# Altium project CurrentMonitorAndController.PrjPcb (part 1 of 2)
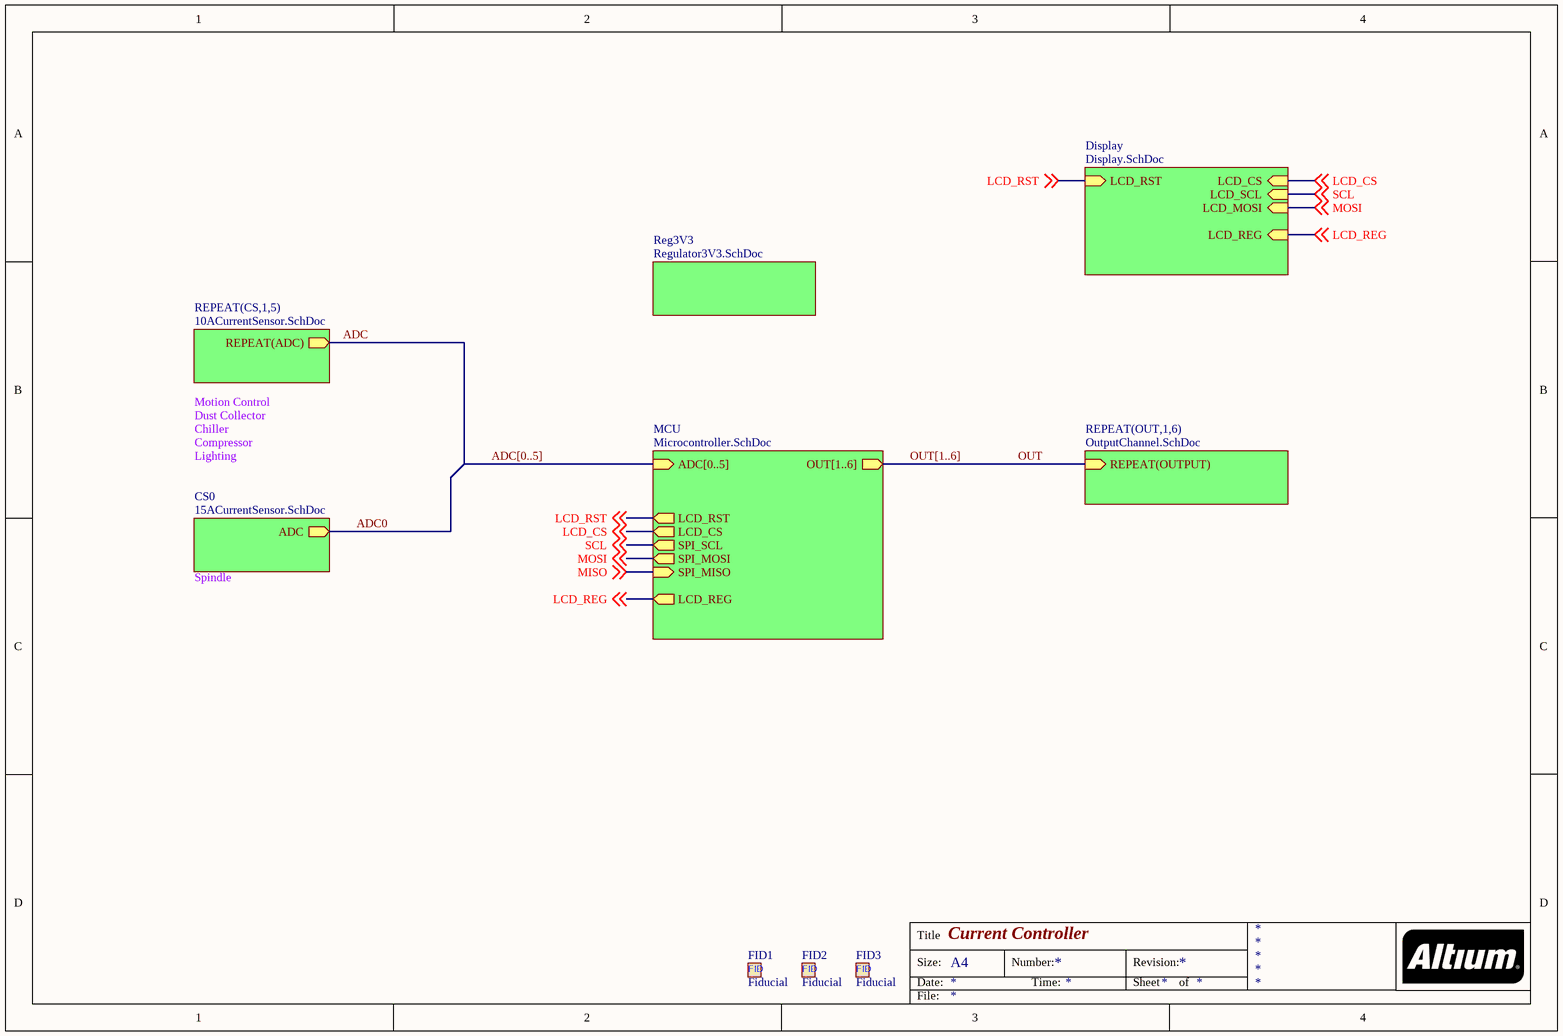
[diagram p0: CurrentManager-top.SchDoc]
7 sheets, 179 parts. Net scope: hierarchical (ports join the sheet entries above them; power ports are global).
Board file: Current Controller Board.PcbDoc
Sheets:
  CurrentManager-top.SchDoc
    CS1 = 10ACurrentSensor.SchDoc
    CS2 = 10ACurrentSensor.SchDoc
    CS3 = 10ACurrentSensor.SchDoc
    CS4 = 10ACurrentSensor.SchDoc
    CS5 = 10ACurrentSensor.SchDoc
    CS0 = 15ACurrentSensor.SchDoc
    MCU = Microcontroller.SchDoc
    Display = Display.SchDoc
    Reg3V3 = Regulator3V3.SchDoc
    OUT1 = OutputChannel.SchDoc
    OUT2 = OutputChannel.SchDoc
    OUT3 = OutputChannel.SchDoc
    OUT4 = OutputChannel.SchDoc
    OUT5 = OutputChannel.SchDoc
    OUT6 = OutputChannel.SchDoc

## Sheet CurrentManager-top.SchDoc: Current Controller
size A4

### Parts
FID1  Fiducial  [Fiducial]  (no BOM)
FID2  Fiducial  [Fiducial]  (no BOM)
FID3  Fiducial  [Fiducial]  (no BOM)

### Sub-sheets
CS0 = 15ACurrentSensor.SchDoc: ADC (out)
Display = Display.SchDoc: LCD_RST (in), LCD_CS (in), LCD_SCL (in), LCD_MOSI (in), LCD_REG (in)
MCU = Microcontroller.SchDoc: ADC[0..5] (in), LCD_RST (out), LCD_CS (out), SPI_SCL (out), SPI_MOSI (out), LCD_REG (out), SPI_MISO (in), OUT[1..6] (out)
Reg3V3 = Regulator3V3.SchDoc: no entries
REPEAT(CS,1,5) = 10ACurrentSensor.SchDoc: REPEAT(ADC) (out)
REPEAT(OUT,1,6) = OutputChannel.SchDoc: REPEAT(OUTPUT) (in)

### Nets
ADC: sheet REPEAT(CS,1,5)/REPEAT(ADC)
LCD_CS: off-sheet LCD_CS, sheet MCU/LCD_CS, sheet Display/LCD_CS
LCD_REG: off-sheet LCD_REG, sheet MCU/LCD_REG, sheet Display/LCD_REG
LCD_RST: off-sheet LCD_RST, sheet MCU/LCD_RST, sheet Display/LCD_RST
MISO: off-sheet MISO, sheet MCU/SPI_MISO  [project net SPI_MISO]
MOSI: off-sheet MOSI, sheet MCU/SPI_MOSI, sheet Display/LCD_MOSI  [project net SPI_MOSI]
OUT: sheet REPEAT(OUT,1,6)/REPEAT(OUTPUT)
SCL: off-sheet SCL, sheet MCU/SPI_SCL, sheet Display/LCD_SCL

### Buses and harness runs
bus ADC[0..5] = sheet MCU/ADC[0..5]
bus OUT[1..6] = sheet MCU/OUT[1..6]

### Notes on the sheet
- Motion Control
- Dust Collector
- Compressor
- Chiller
- Lighting
- Spindle
- Title
- Size:
- Date:
- A4
- Number:
- Time:
- Revision:
- Sheet
- of
- File:
- (in symbol Fiducial) FID

## Sheet 10ACurrentSensor.SchDoc
size A4
Used 5 times, as channels CS1, CS2, CS3, CS4, CS5. Parts and nets are listed once, with the designators drawn on the sheet.
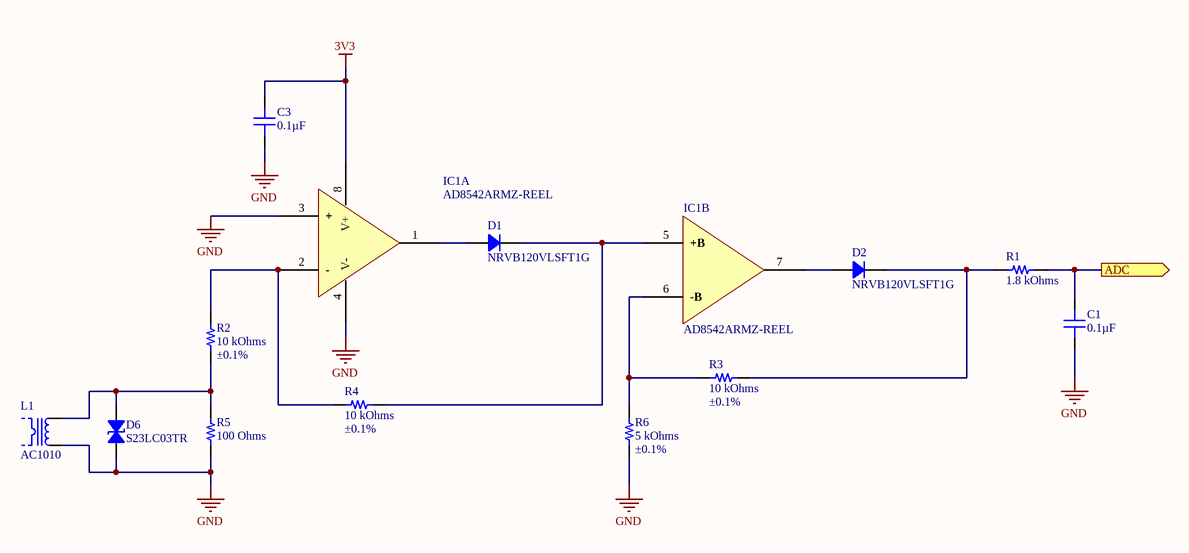
[diagram p1: 10ACurrentSensor.SchDoc]

### Parts
C1  0.1µF  [CAP 0603_1608]
C3  0.1µF  [CAP 0603_1608]
D1  NRVB120VLSFT1G  [SOD123F]
D2  NRVB120VLSFT1G  [SOD123F]
D6  S23LC03TR  [DIODES SOT-23-3]
IC1  AD8542ARMZ-REEL  [ANALOG MSOP-8 RM-8]  (parts A,B of 2)
L1  AC1010  [TALEMA AC1010]
R1  1.8 kOhms  [RES 0603_1608]
R2  Tolerance: ±0.1%  [RES 0603_1608]  (hidden comment: 10 kOhms)
R3  Tolerance: ±0.1%  [RES 0603_1608]  (hidden comment: 10 kOhms)
R4  Tolerance: ±0.1%  [RES 0603_1608]  (hidden comment: 10 kOhms)
R5  100 Ohms  [RES 0603_1608]
R6  Tolerance: ±0.1%  [RES 0603_1608]  (hidden comment: 5 kOhms)

### Ports
ADC (out)

### Nets
3V3: C3.2 IC1.8(V+)
GND: C1.1 C3.1 D6.1 IC1.3(+) IC1.4(V-) L1.1 R5.1 R6.2
ADC: C1.2 R1.2 ; port ADC
NetD1_1: D1.1 IC1.1(OUT)
NetD1_2: D1.2 IC1.5(+B) R4.1
NetD2_1: D2.1 IC1.7(OUT_B)
NetD2_2: D2.2 R1.1 R3.1
NetD6_2: D6.2 L1.2 R2.1 R5.2
NetIC1_2: IC1.2(-) R2.2 R4.2
NetIC1_6: IC1.6(-B) R3.2 R6.1

### Channels
CS1: designators end in _CS1; ports ADC=ADC1
CS2: designators end in _CS2; ports ADC=ADC2
CS3: designators end in _CS3; ports ADC=ADC3
CS4: designators end in _CS4; ports ADC=ADC4
CS5: designators end in _CS5; ports ADC=ADC5

### Notes on the sheet
- Title
- Size:
- Date:
- A4
- Number:
- Time:
- Revision:
- Sheet
- of
- File:

### Library data of the parts
C1 C3 = CS0603KRX7R7BB104: CAP CER 0.1UF 16V X7R 0603; Manufacturer: Yageo; Tolerance: ±10%; Part Number: CS0603KRX7R7BB104; Value: 0.1µF; Applications: Boardflex Sensitive; Capacitance: 0.1µF; ComponentLink1Description: Datasheet; ComponentLink1URL: http://www.yageo.com/NewPortal/yageodocoutput?fileName=/pdf/MLCC/UPY-ST_NPOX7R_16V-to-3KV_5.pdf; ComponentLink2Description: DigiKey Link; ComponentLink2URL: http://digikey.com/product-detail/en/yageo/CS0603KRX7R7BB104/311-3560-1-ND/7648487; Device Package: 0603 (1608 Metric); Features: Soft Termination; LastUpdated: 02/01/2020 00:02:08; Lifecycle Status: Active; Minimum Order: 1; Mounting Type: Surface Mount, MLCC; Operating Temperature: -55°C ~ 125°C; Package / Case: 0603 (1608 Metric); Packaging: ReReel; PartId: 2286; Part Status: Active; Price: 0.00; Series: CS; Size / Dimension: 0.063" L x 0.031" W (1.60mm x 0.80mm); Supplier 1: DigiKey; Supplier Part Number 1: 311-3560-1-ND; Temperature Coefficient: X7R; Thickness (Max): 0.037" (0.95mm); Voltage - Rated: 16V
D1 D2 = NRVB120VLSFT1G: DIODE SCHOTTKY 20V 1A SOD123; Manufacturer: ON Semiconductor; Current - Reverse Leakage @ Vr: 15mA @ 20V; Speed: Fast Recovery =< 500ns, > 200mA (Io); Voltage - Forward (Vf) (Max) @ If: 300mV @ 1A; Part Number: NRVB120VLSFT1G; ComponentLink1Description: Datasheet; ComponentLink1URL: http://www.onsemi.com/pub/Collateral/MBR120VLSFT1-D.PDF; ComponentLink2Description: DigiKey Link; ComponentLink2URL: http://digikey.com/product-detail/en/on-semiconductor/NRVB120VLSFT1G/NRVB120VLSFT1GOSCT-ND/8538727; Current - Average Rectified (Io): 1A; Device Package: SOD-123F; Diode Type: Schottky; LastUpdated: 02/01/2020 00:13:05; Lifecycle Status: Active; Minimum Order: 1; Mounting Type: Surface Mount; Operating Temperature - Junction: -65°C ~ 125°C; Package / Case: SOD-123F; Packaging: ReReel; PartId: 2453; Part Status: Active; Price: 0.00; Series: Automotive, AEC-Q101; Supplier 1: DigiKey; Supplier Part Number 1: NRVB120VLSFT1GOSCT-ND; Supplier Device Package: SOD-123FL; Voltage - DC Reverse (Vr) (Max): 20V
D6 = S23LC03TR: TVS DIODE 3.3V 8V SOT23; Manufacturer: SMC Diode Solutions; Capacitance @ Frequency: 3pF @ 1MHz; Current - Peak Pulse (10/1000µs): 1A; Power Line Protection: No; Power - Peak Pulse: 300W; Type: Zener; Unidirectional Channels: 1; Voltage - Breakdown (Min): 4V; Voltage - Reverse Standoff (Typ): 3.3V (Max); Part Number: S23LC03TR; Applications: General Purpose; ComponentLink1Description: Datasheet; ComponentLink1URL: http://www.smc-diodes.com/propdf/S23LC03%20THRU%20S23LC24%20N0292%20REV.A.pdf; ComponentLink2Description: DigiKey Link; ComponentLink2URL: http://digikey.com/product-detail/en/smc-diode-solutions/S23LC03TR/1655-1994-1-ND/9562561; Device Package: TO-236-3, SC-59, SOT-23-3; LastUpdated: 12/01/2020 00:14:20; Lifecycle Status: Active; Minimum Order: 1; Mounting Type: Surface Mount; Operating Temperature: -55°C ~ 125°C (TJ); Package / Case: TO-236-3, SC-59, SOT-23-3; Packaging: TapeAndReel; PartId: 346; Part Status: Active; Price: 0.04; Series: -; Supplier 1: DigiKey; Supplier Part Number 1: 1655-1994-1-ND; Supplier Device Package: SOT-23; Voltage - Clamping (Max) @ Ipp: 8V
IC1 = AD8542ARMZ-REEL: IC OPAMP GP 2 CIRCUIT 8MSOP; Manufacturer: Analog Devices Inc.; Amplifier Type: General Purpose; Current - Input Bias: 4pA; Current - Output / Channel: 30mA; Current - Supply: 45µA; Gain Bandwidth Product: 1MHz; Number of Circuits: 2; Output Type: Rail-to-Rail; Slew Rate: 0.92V/µs; Voltage - Input Offset: 1mV; Voltage - Supply, Single/Dual (±): 2.7V ~ 5.5V; Part Number: AD8542ARMZ-REEL; ComponentLink1Description: Datasheet; ComponentLink1URL: https://www.analog.com/media/en/technical-documentation/data-sheets/AD8541_8542_8544.pdf; ComponentLink2Description: DigiKey Link; ComponentLink2URL: http://digikey.com/product-detail/en/analog-devices-inc/AD8542ARMZ-REEL/AD8542ARMZ-REELCT-ND/1957825; Device Package: 8-TSSOP, 8-MSOP (0.118", 3.00mm Width); LastUpdated: 08/01/2020 23:28:44; Lifecycle Status: Active; Minimum Order: 1; Mounting Type: Surface Mount; Operating Temperature: -40°C ~ 125°C; Package / Case: 8-TSSOP, 8-MSOP (0.118", 3.00mm Width); Packaging: ReReel; PartId: 7; Part Status: Active; Price: 0.00; Series: -; Supplier 1: DigiKey; Supplier Part Number 1: AD8542ARMZ-REELCT-ND; Supplier Device Package: 8-MSOP
L1 = AC1010: CURR SENSE XFMR 10A T/H; Manufacturer: Talema Group LLC; Current Ratio: 1000:1; DC Resistance (DCR): 41.8Ohm; Frequency Range: 50/60Hz; Type: Non-Invasive (Solid Core); Part Number: AC1010; ComponentLink1Description: Datasheet; ComponentLink1URL: http://www.talema.com/uploads/documents/product-datasheets/AC%20Series.pdf; ComponentLink2Description: DigiKey Link; ComponentLink2URL: http://digikey.com/product-detail/en/talema-group-llc/AC1010/1295-1102-ND/3881333; Current Rating (Amps): 10A; Height - Seated (Max): 0.937" (23.80mm); LastUpdated: 07/01/2020 18:42:16; Lifecycle Status: Active; Minimum Order: 1; Mounting Type: Through Hole; Packaging: Tube; Part Status: Active; Price: 5.81; Series: AC; Size / Dimension: 0.937" L x 0.438" W (23.80mm x 11.12mm); Supplier 1: DigiKey; Supplier Part Number 1: 1295-1102-ND; Termination Style: PC Pin
R1 = RMCF0603JT1K80: RES 1.8K OHM 5% 1/10W 0603; Manufacturer: Stackpole Electronics Inc; Power (Watts): 0.1W, 1/10W; Temperature Coefficient: ±200ppm/°C; Part Number: RMCF0603JT1K80; Value: 1.8 kOhms; ComponentLink1Description: Datasheet; ComponentLink1URL: https://www.seielect.com/catalog/sei-rmcf_rmcp.pdf; ComponentLink2Description: DigiKey Link; ComponentLink2URL: http://digikey.com/product-detail/en/stackpole-electronics-inc/RMCF0603JT1K80/RMCF0603JT1K80CT-ND/1943176; Composition: Thick Film; Device Package: 0603 (1608 Metric); Features: Automotive AEC-Q200; Height - Seated (Max): 0.022" (0.55mm); LastUpdated: 02/01/2020 00:07:01; Lifecycle Status: Active; Minimum Order: 1; Number of Terminations: 2; Operating Temperature: -55°C ~ 155°C; Package / Case: 0603 (1608 Metric); Packaging: TapeAndReel; PartId: 5907; Part Status: Active; Price: 0.00; Ratings: AEC-Q200; Resistance: 1.8 kOhms; Series: RMCF; Size / Dimension: 0.061" L x 0.031" W (1.55mm x 0.80mm); Supplier 1: DigiKey; Supplier Part Number 1: RMCF0603JT1K80CT-ND; Supplier Device Package: 0603; Tolerance: ±5%
R2-R4 = ERA-3AEB103V: RES SMD 10K OHM 0.1% 1/10W 0603; Manufacturer: Panasonic Electronic Components; Power (Watts): 0.1W, 1/10W; Temperature Coefficient: ±25ppm/°C; Part Number: ERA-3AEB103V; Value: 10 kOhms; ComponentLink1Description: Datasheet; ComponentLink1URL: https://industrial.panasonic.com/cdbs/www-data/pdf/RDM0000/AOA0000C307.pdf; ComponentLink2Description: DigiKey Link; ComponentLink2URL: http://digikey.com/product-detail/en/panasonic-electronic-components/ERA-3AEB103V/P10KDBCT-ND/1466076; Composition: Thin Film; Device Package: 0603 (1608 Metric); Features: Automotive AEC-Q200; Height - Seated (Max): 0.022" (0.55mm); LastUpdated: 02/01/2020 00:07:02; Lifecycle Status: Active; Minimum Order: 1; Number of Terminations: 2; Operating Temperature: -55°C ~ 155°C; Package / Case: 0603 (1608 Metric); Packaging: ReReel; PartId: 5506; Part Status: Active; Price: 0.00; Ratings: AEC-Q200; Resistance: 10 kOhms; Series: ERA-3A; Size / Dimension: 0.063" L x 0.031" W (1.60mm x 0.80mm); Supplier 1: DigiKey; Supplier Part Number 1: P10KDBCT-ND; Supplier Device Package: 0603
R5 = ESR03EZPJ101: RES SMD 100 OHM 5% 1/4W 0603; Manufacturer: Rohm Semiconductor; Power (Watts): 0.25W, 1/4W; Temperature Coefficient: ±200ppm/°C; Part Number: ESR03EZPJ101; Value: 100 Ohms; ComponentLink1Description: Datasheet; ComponentLink1URL: https://www.rohm.com/datasheet/ESR01MZPF/esr-e; ComponentLink2Description: DigiKey Link; ComponentLink2URL: http://digikey.com/product-detail/en/rohm-semiconductor/ESR03EZPJ101/RHM100DCT-ND/1983776; Composition: Thick Film; Device Package: 0603 (1608 Metric); Features: Automotive AEC-Q200, Pulse Withstanding; Height - Seated (Max): 0.022" (0.55mm); LastUpdated: 02/01/2020 00:07:02; Lifecycle Status: Active; Minimum Order: 1; Number of Terminations: 2; Operating Temperature: -55°C ~ 155°C; Package / Case: 0603 (1608 Metric); Packaging: ReReel; PartId: 5450; Part Status: Active; Price: 0.00; Ratings: AEC-Q200; Resistance: 100 Ohms; Series: ESR; Size / Dimension: 0.063" L x 0.031" W (1.60mm x 0.80mm); Supplier 1: DigiKey; Supplier Part Number 1: RHM100DCT-ND; Supplier Device Package: 0603; Tolerance: ±5%
R6 = PNM0603E5001BST5: RES SMD 5K OHM 0.1% 0.15W 0603; Manufacturer: Vishay Thin Film; Temperature Coefficient: ±25ppm/°C; Part Number: PNM0603E5001BST5; Value: 5 kOhms; ComponentLink1Description: Datasheet; ComponentLink1URL: http://www.vishay.com/docs/60057/pnm.pdf; ComponentLink2Description: DigiKey Link; ComponentLink2URL: http://digikey.com/product-detail/en/vishay-thin-film/PNM0603E5001BST5/PNM0603-5.0KBCT-ND/2120383; Composition: Thin Film; Device Package: 0603 (1608 Metric); Features: Anti-Sulfur, Moisture Resistant, Non-Inductive, Non-Magnetic; Height - Seated (Max): 0.020" (0.51mm); LastUpdated: 02/01/2020 00:06:54; Lifecycle Status: Active; Minimum Order: 1; Number of Terminations: 2; Operating Temperature: -55°C ~ 155°C; Package / Case: 0603 (1608 Metric); Packaging: ReReel; PartId: 11960; Part Status: Active; Power (Watts): 0.15W; Price: 0.00; Resistance: 5 kOhms; Series: PNM; Size / Dimension: 0.064" L x 0.032" W (1.63mm x 0.81mm); Supplier 1: DigiKey; Supplier Part Number 1: PNM0603-5.0KBCT-ND; Supplier Device Package: 0603

## Sheet 15ACurrentSensor.SchDoc
size A4
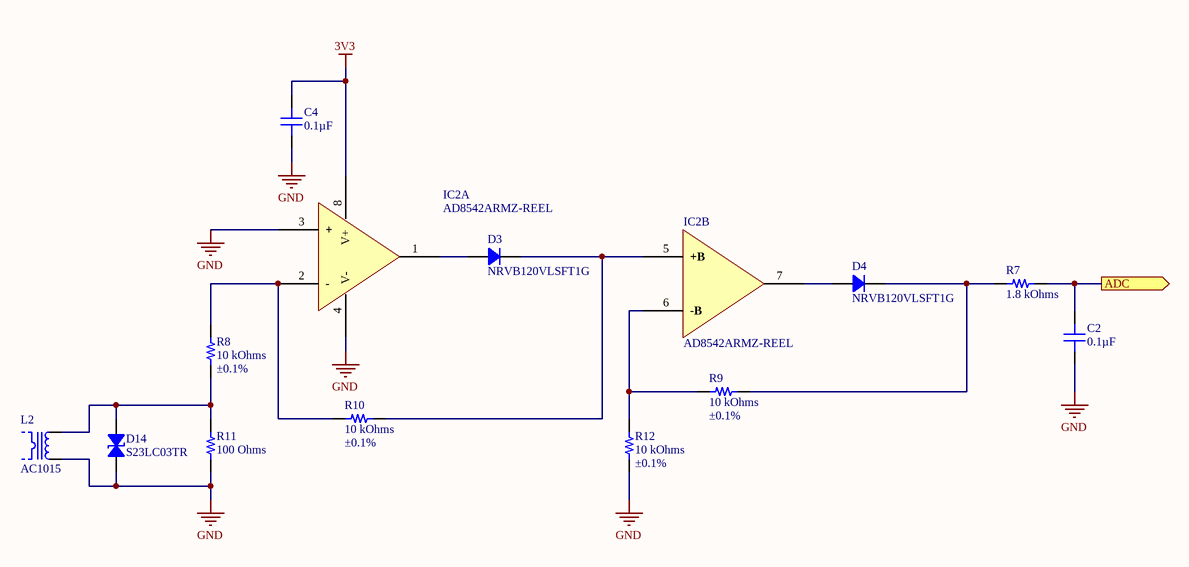
[diagram p2: 15ACurrentSensor.SchDoc]

### Parts
C2  0.1µF  [CAP 0603_1608]
C4  0.1µF  [CAP 0603_1608]
D3  NRVB120VLSFT1G  [SOD123F]
D4  NRVB120VLSFT1G  [SOD123F]
D14  S23LC03TR  [DIODES SOT-23-3]
IC2  AD8542ARMZ-REEL  [ANALOG MSOP-8 RM-8]  (parts A,B of 2)
L2  AC1015  [TALEMA AC1015]
R7  1.8 kOhms  [RES 0603_1608]
R8  Tolerance: ±0.1%  [RES 0603_1608]  (hidden comment: 10 kOhms)
R9  Tolerance: ±0.1%  [RES 0603_1608]  (hidden comment: 10 kOhms)
R10  Tolerance: ±0.1%  [RES 0603_1608]  (hidden comment: 10 kOhms)
R11  100 Ohms  [RES 0603_1608]
R12  Tolerance: ±0.1%  [RES 0603_1608]  (hidden comment: 10 kOhms)

### Ports
ADC (out)

### Nets
3V3: C4.2 IC2.8(V+)
GND: C2.1 C4.1 D14.1 IC2.3(+) IC2.4(V-) L2.1 R11.1 R12.2
ADC0: C2.2 R7.2 ; port ADC
NetD3_1: D3.1 IC2.1(OUT)
NetD3_2: D3.2 IC2.5(+B) R10.1
NetD4_1: D4.1 IC2.7(OUT_B)
NetD4_2: D4.2 R7.1 R9.1
NetD14_2: D14.2 L2.2 R8.1 R11.2
NetIC2_2: IC2.2(-) R8.2 R10.2
NetIC2_6: IC2.6(-B) R9.2 R12.1

### Notes on the sheet
- Title
- Size:
- Date:
- A4
- Number:
- Time:
- Revision:
- Sheet
- of
- File:

### Library data of the parts
C2 C4 = CS0603KRX7R7BB104: as C1 on sheet 10ACurrentSensor; Part Number: CS0603KRX7R7BB104; Value: 0.1µF; Applications: Boardflex Sensitive; Capacitance: 0.1µF; ComponentLink1Description: Datasheet; ComponentLink1URL: http://www.yageo.com/NewPortal/yageodocoutput?fileName=/pdf/MLCC/UPY-ST_NPOX7R_16V-to-3KV_5.pdf; ComponentLink2Description: DigiKey Link; ComponentLink2URL: http://digikey.com/product-detail/en/yageo/CS0603KRX7R7BB104/311-3560-1-ND/7648487; Device Package: 0603 (1608 Metric); Features: Soft Termination; LastUpdated: 02/01/2020 00:02:08; Lifecycle Status: Active; Minimum Order: 1; Mounting Type: Surface Mount, MLCC; Operating Temperature: -55°C ~ 125°C; Package / Case: 0603 (1608 Metric); Packaging: ReReel; PartId: 2286; Part Status: Active; Price: 0.00; Series: CS; Size / Dimension: 0.063" L x 0.031" W (1.60mm x 0.80mm); Supplier 1: DigiKey; Supplier Part Number 1: 311-3560-1-ND; Temperature Coefficient: X7R; Thickness (Max): 0.037" (0.95mm); Voltage - Rated: 16V
D3 D4 = NRVB120VLSFT1G: as D1 on sheet 10ACurrentSensor; Part Number: NRVB120VLSFT1G; ComponentLink1Description: Datasheet; ComponentLink1URL: http://www.onsemi.com/pub/Collateral/MBR120VLSFT1-D.PDF; ComponentLink2Description: DigiKey Link; ComponentLink2URL: http://digikey.com/product-detail/en/on-semiconductor/NRVB120VLSFT1G/NRVB120VLSFT1GOSCT-ND/8538727; Current - Average Rectified (Io): 1A; Device Package: SOD-123F; Diode Type: Schottky; LastUpdated: 02/01/2020 00:13:05; Lifecycle Status: Active; Minimum Order: 1; Mounting Type: Surface Mount; Operating Temperature - Junction: -65°C ~ 125°C; Package / Case: SOD-123F; Packaging: ReReel; PartId: 2453; Part Status: Active; Price: 0.00; Series: Automotive, AEC-Q101; Supplier 1: DigiKey; Supplier Part Number 1: NRVB120VLSFT1GOSCT-ND; Supplier Device Package: SOD-123FL; Voltage - DC Reverse (Vr) (Max): 20V
D14 = S23LC03TR: as D6 on sheet 10ACurrentSensor; Part Number: S23LC03TR; Applications: General Purpose; ComponentLink1Description: Datasheet; ComponentLink1URL: http://www.smc-diodes.com/propdf/S23LC03%20THRU%20S23LC24%20N0292%20REV.A.pdf; ComponentLink2Description: DigiKey Link; ComponentLink2URL: http://digikey.com/product-detail/en/smc-diode-solutions/S23LC03TR/1655-1994-1-ND/9562561; Device Package: TO-236-3, SC-59, SOT-23-3; LastUpdated: 12/01/2020 00:14:20; Lifecycle Status: Active; Minimum Order: 1; Mounting Type: Surface Mount; Operating Temperature: -55°C ~ 125°C (TJ); Package / Case: TO-236-3, SC-59, SOT-23-3; Packaging: TapeAndReel; PartId: 346; Part Status: Active; Price: 0.04; Series: -; Supplier 1: DigiKey; Supplier Part Number 1: 1655-1994-1-ND; Supplier Device Package: SOT-23; Voltage - Clamping (Max) @ Ipp: 8V
IC2 = AD8542ARMZ-REEL: as IC1 on sheet 10ACurrentSensor; Part Number: AD8542ARMZ-REEL; ComponentLink1Description: Datasheet; ComponentLink1URL: https://www.analog.com/media/en/technical-documentation/data-sheets/AD8541_8542_8544.pdf; ComponentLink2Description: DigiKey Link; ComponentLink2URL: http://digikey.com/product-detail/en/analog-devices-inc/AD8542ARMZ-REEL/AD8542ARMZ-REELCT-ND/1957825; Device Package: 8-TSSOP, 8-MSOP (0.118", 3.00mm Width); LastUpdated: 08/01/2020 23:28:44; Lifecycle Status: Active; Minimum Order: 1; Mounting Type: Surface Mount; Operating Temperature: -40°C ~ 125°C; Package / Case: 8-TSSOP, 8-MSOP (0.118", 3.00mm Width); Packaging: ReReel; PartId: 7; Part Status: Active; Price: 0.00; Series: -; Supplier 1: DigiKey; Supplier Part Number 1: AD8542ARMZ-REELCT-ND; Supplier Device Package: 8-MSOP
L2 = AC1015: CURR SENSE XFMR 15A T/H; Manufacturer: Talema Group LLC; Current Ratio: 1000:1; DC Resistance (DCR): 41.8Ohm; Frequency Range: 50/60Hz; Type: Non-Invasive (Solid Core); Part Number: AC1015; ComponentLink1Description: Datasheet; ComponentLink1URL: http://www.talema.com/uploads/documents/product-datasheets/AC%20Series.pdf; ComponentLink2Description: DigiKey Link; ComponentLink2URL: http://digikey.com/product-detail/en/talema-group-llc/AC1015/1295-1097-ND/3881397; Current Rating (Amps): 15A; Height - Seated (Max): 0.937" (23.80mm); LastUpdated: 07/01/2020 18:42:34; Lifecycle Status: Active; Minimum Order: 1; Mounting Type: Through Hole; Packaging: Tube; Part Status: Active; Price: 5.81; Series: AC; Size / Dimension: 0.937" L x 0.438" W (23.80mm x 11.12mm); Supplier 1: DigiKey; Supplier Part Number 1: 1295-1097-ND; Termination Style: PC Pin
R7 = RMCF0603JT1K80: as R1 on sheet 10ACurrentSensor; Part Number: RMCF0603JT1K80; Value: 1.8 kOhms; ComponentLink1Description: Datasheet; ComponentLink1URL: https://www.seielect.com/catalog/sei-rmcf_rmcp.pdf; ComponentLink2Description: DigiKey Link; ComponentLink2URL: http://digikey.com/product-detail/en/stackpole-electronics-inc/RMCF0603JT1K80/RMCF0603JT1K80CT-ND/1943176; Composition: Thick Film; Device Package: 0603 (1608 Metric); Features: Automotive AEC-Q200; Height - Seated (Max): 0.022" (0.55mm); LastUpdated: 02/01/2020 00:07:01; Lifecycle Status: Active; Minimum Order: 1; Number of Terminations: 2; Operating Temperature: -55°C ~ 155°C; Package / Case: 0603 (1608 Metric); Packaging: TapeAndReel; PartId: 5907; Part Status: Active; Price: 0.00; Ratings: AEC-Q200; Resistance: 1.8 kOhms; Series: RMCF; Size / Dimension: 0.061" L x 0.031" W (1.55mm x 0.80mm); Supplier 1: DigiKey; Supplier Part Number 1: RMCF0603JT1K80CT-ND; Supplier Device Package: 0603; Tolerance: ±5%
R8-R10 R12 = ERA-3AEB103V: as R2 on sheet 10ACurrentSensor; Part Number: ERA-3AEB103V; Value: 10 kOhms; ComponentLink1Description: Datasheet; ComponentLink1URL: https://industrial.panasonic.com/cdbs/www-data/pdf/RDM0000/AOA0000C307.pdf; ComponentLink2Description: DigiKey Link; ComponentLink2URL: http://digikey.com/product-detail/en/panasonic-electronic-components/ERA-3AEB103V/P10KDBCT-ND/1466076; Composition: Thin Film; Device Package: 0603 (1608 Metric); Features: Automotive AEC-Q200; Height - Seated (Max): 0.022" (0.55mm); LastUpdated: 02/01/2020 00:07:02; Lifecycle Status: Active; Minimum Order: 1; Number of Terminations: 2; Operating Temperature: -55°C ~ 155°C; Package / Case: 0603 (1608 Metric); Packaging: ReReel; PartId: 5506; Part Status: Active; Price: 0.00; Ratings: AEC-Q200; Resistance: 10 kOhms; Series: ERA-3A; Size / Dimension: 0.063" L x 0.031" W (1.60mm x 0.80mm); Supplier 1: DigiKey; Supplier Part Number 1: P10KDBCT-ND; Supplier Device Package: 0603
R11 = ESR03EZPJ101: as R5 on sheet 10ACurrentSensor; Part Number: ESR03EZPJ101; Value: 100 Ohms; ComponentLink1Description: Datasheet; ComponentLink1URL: https://www.rohm.com/datasheet/ESR01MZPF/esr-e; ComponentLink2Description: DigiKey Link; ComponentLink2URL: http://digikey.com/product-detail/en/rohm-semiconductor/ESR03EZPJ101/RHM100DCT-ND/1983776; Composition: Thick Film; Device Package: 0603 (1608 Metric); Features: Automotive AEC-Q200, Pulse Withstanding; Height - Seated (Max): 0.022" (0.55mm); LastUpdated: 02/01/2020 00:07:02; Lifecycle Status: Active; Minimum Order: 1; Number of Terminations: 2; Operating Temperature: -55°C ~ 155°C; Package / Case: 0603 (1608 Metric); Packaging: ReReel; PartId: 5450; Part Status: Active; Price: 0.00; Ratings: AEC-Q200; Resistance: 100 Ohms; Series: ESR; Size / Dimension: 0.063" L x 0.031" W (1.60mm x 0.80mm); Supplier 1: DigiKey; Supplier Part Number 1: RHM100DCT-ND; Supplier Device Package: 0603; Tolerance: ±5%

## Sheet Microcontroller.SchDoc: Microcontroller
size A4
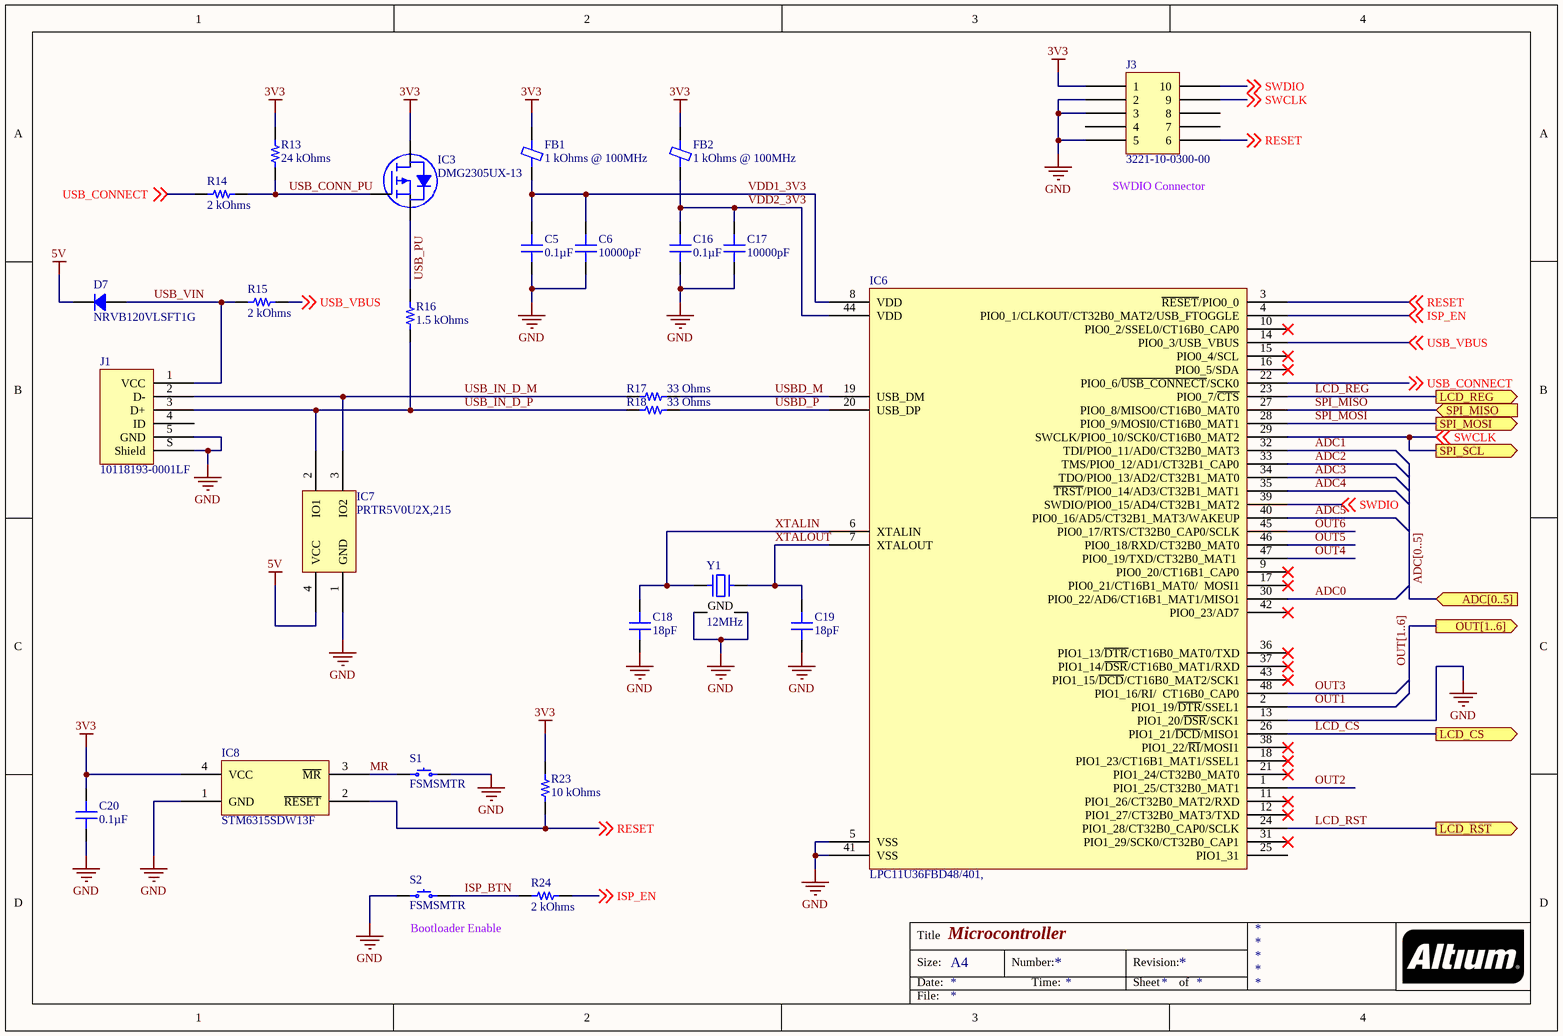
[diagram p3: Microcontroller.SchDoc]

### Parts
C5  0.1µF  [CAP 0603_1608]
C6  10000pF  [CAP 0603_1608]
C16  0.1µF  [CAP 0603_1608]
C17  10000pF  [CAP 0603_1608]
C18  18pF  [CAP 0603_1608]
C19  18pF  [CAP 0603_1608]
C20  0.1µF  [CAP 0603_1608]
D7  NRVB120VLSFT1G  [SOD123F]
FB1  1 kOhms @ 100MHz  [FER 0603_1608]
FB2  1 kOhms @ 100MHz  [FER 0603_1608]
IC3  DMG2305UX-13  [DIODES SOT-23-3]
IC6  LPC11U36FBD48/401,  [NXP LQFP-48 7X7MM]
IC7  PRTR5V0U2X,215  [SOT143B]
IC8  STM6315SDW13F  [ST SOT-143-4]
J1  10118193-0001LF  [FCI USB 10118193-0001LF]
J3  3221-10-0300-00  [CNC TECH 3221-10-0300-00]
R13  24 kOhms  [RES 0603_1608]
R14  2 kOhms  [RES 0603_1608]
R15  2 kOhms  [RES 0603_1608]
R16  1.5 kOhms  [RES 0603_1608]
R17  33 Ohms  [RES 0603_1608]
R18  33 Ohms  [RES 0603_1608]
R23  10 kOhms  [RES 0603_1608]
R24  2 kOhms  [RES 0603_1608]
S1  FSMSMTR  [TE FSMSMTR]
S2  FSMSMTR  [TE FSMSMTR]
Y1  12MHz  [ABRACON ABM8G]

### Ports
ADC[0..5] (in), LCD_CS (out), LCD_REG (out), LCD_RST (out), OUT[1..6] (out), SPI_MISO (in), SPI_MOSI (out), SPI_SCL (out)

### Nets
3V3: C20.2 FB1.2 FB2.2 IC3.3(D) IC8.4(VCC) J3.1 R13.2 R23.2
5V: D7.2 IC7.4(VCC)
GND: C5.1 C6.1 C16.1 C17.1 C18.1 C19.1 C20.1 IC6.5(VSS) IC6.13(PIO1_20/~{DSR}/SCK1) IC6.41(VSS) IC7.1(GND) IC8.1(GND) J1.5(GND) J1.S(Shield) J3.2 J3.3 J3.5 S1.2 S2.1 Y1.2(GND) Y1.4(GND)
ADC0: IC6.30(PIO0_22/AD6/CT16B1_MAT1/MISO1)
ADC1: IC6.32(TDI/PIO0_11/AD0/CT32B0_MAT3)
ADC2: IC6.33(TMS/PIO0_12/AD1/CT32B1_CAP0)
ADC3: IC6.34(TDO/PIO0_13/AD2/CT32B1_MAT0)
ADC4: IC6.35(~{TRST}/PIO0_14/AD3/CT32B1_MAT1)
ADC5: IC6.40(PIO0_16/AD5/CT32B1_MAT3/WAKEUP)
ISP_BTN: R24.1 S2.2
ISP_EN: IC6.4(PIO0_1/CLKOUT/CT32B0_MAT2/USB_FTOGGLE) R24.2 ; off-sheet ISP_EN
LCD_CS: IC6.26(PIO1_21/~{DCD}/MISO1) ; port LCD_CS
LCD_REG: IC6.23(PIO0_7/~{CTS}) ; port LCD_REG
LCD_RST: IC6.24(PIO1_28/CT32B0_CAP0/SCLK) ; port LCD_RST
MR: IC8.3(~{MR}) S1.1
OUT1: IC6.2(PIO1_19/~{DTR}/SSEL1)
OUT2: IC6.1(PIO1_25/CT32B0_MAT1)
OUT3: IC6.48(PIO1_16/RI/__CT16B0_CAP0)
OUT4: IC6.47(PIO0_19/TXD/CT32B0_MAT1)
OUT5: IC6.46(PIO0_18/RXD/CT32B0_MAT0)
OUT6: IC6.45(PIO0_17/RTS/CT32B0_CAP0/SCLK)
RESET: IC6.3(~{RESET}/PIO0_0) IC8.2(~{RESET}) J3.6 R23.1 ; off-sheet RESET
SPI_MISO: IC6.27(PIO0_8/MISO0/CT16B0_MAT0) ; port SPI_MISO
SPI_MOSI: IC6.28(PIO0_9/MOSI0/CT16B0_MAT1) ; port SPI_MOSI
SWCLK: IC6.29(SWCLK/PIO0_10/SCK0/CT16B0_MAT2) J3.9 ; off-sheet SWCLK, port SPI_SCL  [project net SCL]
SWDIO: IC6.39(SWDIO/PIO0_15/AD4/CT32B1_MAT2) J3.10 ; off-sheet SWDIO
USB_CONN_PU: IC3.1(G) R13.1 R14.2
USB_CONNECT: IC6.22(PIO0_6/~{USB_CONNECT}/SCK0) R14.1 ; off-sheet USB_CONNECT
USB_IN_D_M: IC7.3(IO2) J1.2(D-) R17.1
USB_IN_D_P: IC7.2(IO1) J1.3(D+) R16.1 R18.1
USB_PU: IC3.2(S) R16.2
USB_VBUS: IC6.14(PIO0_3/USB_VBUS) R15.2 ; off-sheet USB_VBUS
USB_VIN: D7.1 J1.1(VCC) R15.1
USBD_M: IC6.19(USB_DM) R17.2
USBD_P: IC6.20(USB_DP) R18.2
VDD1_3V3: C5.2 C6.2 FB1.1 IC6.8(VDD)
VDD2_3V3: C16.2 C17.2 FB2.1 IC6.44(VDD)
XTALIN: C18.2 IC6.6(XTALIN) Y1.1
XTALOUT: C19.2 IC6.7(XTALOUT) Y1.3

Not connected (* = marked no-connect by the designer): IC6 9(PIO0_20/CT16B1_CAP0)* 10(PIO0_2/SSEL0/CT16B0_CAP0)* 11(PIO1_26/CT32B0_MAT2/RXD)* 12(PIO1_27/CT32B0_MAT3/TXD)* 15(PIO0_4/SCL)* 16(PIO0_5/SDA)* 17(PIO0_21/CT16B1_MAT0/__MOSI1)* 18(PIO1_23/CT16B1_MAT1/SSEL1)* 21(PIO1_24/CT32B0_MAT0)* 25(PIO1_31) 31(PIO1_29/SCK0/CT32B0_CAP1)* 36(PIO1_13/~{DTR}/CT16B0_MAT0/TXD)* 37(PIO1_14/~{DSR}/CT16B0_MAT1/RXD)* 38(PIO1_22/~{RI}/MOSI1)* 42(PIO0_23/AD7)* 43(PIO1_15/~{DCD}/CT16B0_MAT2/SCK1)*; J1 4(ID); J3 4 7 8

### Buses and harness runs
bus ADC[0..5] = port ADC[0..5]
bus OUT[1..6] = port OUT[1..6]

### Notes on the sheet
- (near J3) SWDIO Connector
- Bootloader Enable
- Title
- Size:
- Date:
- A4
- Number:
- Time:
- Revision:
- Sheet
- of
- File:

### Library data of the parts
C5 C16 C20 = CS0603KRX7R7BB104: as C1 on sheet 10ACurrentSensor; Part Number: CS0603KRX7R7BB104; Value: 0.1µF; Applications: Boardflex Sensitive; Capacitance: 0.1µF; ComponentLink1Description: Datasheet; ComponentLink1URL: http://www.yageo.com/NewPortal/yageodocoutput?fileName=/pdf/MLCC/UPY-ST_NPOX7R_16V-to-3KV_5.pdf; ComponentLink2Description: DigiKey Link; ComponentLink2URL: http://digikey.com/product-detail/en/yageo/CS0603KRX7R7BB104/311-3560-1-ND/7648487; Device Package: 0603 (1608 Metric); Features: Soft Termination; LastUpdated: 02/01/2020 00:02:08; Lifecycle Status: Active; Minimum Order: 1; Mounting Type: Surface Mount, MLCC; Operating Temperature: -55°C ~ 125°C; Package / Case: 0603 (1608 Metric); Packaging: ReReel; PartId: 2286; Part Status: Active; Price: 0.00; Series: CS; Size / Dimension: 0.063" L x 0.031" W (1.60mm x 0.80mm); Supplier 1: DigiKey; Supplier Part Number 1: 311-3560-1-ND; Temperature Coefficient: X7R; Thickness (Max): 0.037" (0.95mm); Voltage - Rated: 16V
C6 C17 = AC0603KPX7R9BB103: CAP CER 10000PF 50V X7R 0603; Manufacturer: Yageo; Tolerance: ±10%; Part Number: AC0603KPX7R9BB103; Value: 10000pF; Applications: Automotive; Capacitance: 10000pF; ComponentLink1Description: Datasheet; ComponentLink1URL: http://www.yageo.com/NewPortal/_en/search/productDocs.jsp?YageoPartNumber=AC0603KPX7R9BB103; ComponentLink2Description: DigiKey Link; ComponentLink2URL: http://digikey.com/product-detail/en/yageo/AC0603KPX7R9BB103/311-3284-1-ND/6643536; Device Package: 0603 (1608 Metric); LastUpdated: 21/01/2020 00:02:05; Lifecycle Status: Active; Minimum Order: 1; Mounting Type: Surface Mount, MLCC; Operating Temperature: -55°C ~ 125°C; Package / Case: 0603 (1608 Metric); Packaging: TapeAndReel; PartId: 5188; Part Status: Active; Price: 0.01; Ratings: AEC-Q200; Series: AC; Size / Dimension: 0.063" L x 0.031" W (1.60mm x 0.80mm); Supplier 1: DigiKey; Supplier Part Number 1: 311-3284-1-ND; Temperature Coefficient: X7R; Thickness (Max): 0.035" (0.90mm); Voltage - Rated: 50V
C18 C19 = C0603C180K5GACTU: CAP CER 18PF 50V C0G/NP0 0603; Manufacturer: KEMET; Temperature Coefficient: C0G, NP0; Tolerance: ±10%; Part Number: C0603C180K5GACTU; Value: 18pF; Applications: General Purpose; Capacitance: 18pF; ComponentLink1Description: Datasheet; ComponentLink1URL: https://api.kemet.com/component-edge/download/datasheet/C0603C180K5GACTU.pdf; ComponentLink2Description: DigiKey Link; ComponentLink2URL: http://digikey.com/product-detail/en/kemet/C0603C180K5GACTU/399-7866-1-ND/3471589; Device Package: 0603 (1608 Metric); Features: Low ESL; LastUpdated: 21/01/2020 00:02:05; Lifecycle Status: Active; Minimum Order: 1; Mounting Type: Surface Mount, MLCC; Operating Temperature: -55°C ~ 125°C; Package / Case: 0603 (1608 Metric); Packaging: TapeAndReel; PartId: 5275; Part Status: Active; Price: 0.01; Series: SMD Comm C0G; Size / Dimension: 0.063" L x 0.031" W (1.60mm x 0.80mm); Supplier 1: DigiKey; Supplier Part Number 1: 399-7866-1-ND; Thickness (Max): 0.034" (0.87mm); Voltage - Rated: 50V
D7 = NRVB120VLSFT1G: as D1 on sheet 10ACurrentSensor; Part Number: NRVB120VLSFT1G; ComponentLink1Description: Datasheet; ComponentLink1URL: http://www.onsemi.com/pub/Collateral/MBR120VLSFT1-D.PDF; ComponentLink2Description: DigiKey Link; ComponentLink2URL: http://digikey.com/product-detail/en/on-semiconductor/NRVB120VLSFT1G/NRVB120VLSFT1GOSCT-ND/8538727; Current - Average Rectified (Io): 1A; Device Package: SOD-123F; Diode Type: Schottky; LastUpdated: 21/01/2020 02:43:37; Lifecycle Status: Active; Minimum Order: 1; Mounting Type: Surface Mount; Operating Temperature - Junction: -65°C ~ 125°C; Package / Case: SOD-123F; Packaging: TapeAndReel; PartId: 2453; Part Status: Active; Price: 0.15; Series: Automotive, AEC-Q101; Supplier 1: DigiKey; Supplier Part Number 1: NRVB120VLSFT1GOSCT-ND; Supplier Device Package: SOD-123FL; Voltage - DC Reverse (Vr) (Max): 20V
FB1 FB2 = FBTH1608HE102-T: FERRITE BEAD,HIGH CURRENT, 0603; Manufacturer: Taiyo Yuden; Current Rating (Max): 500mA; DC Resistance (DCR) (Max): 350mOhm; Filter Type: Power Line; Number of Lines: 1; Part Number: FBTH1608HE102-T; ComponentLink1Description: Datasheet; ComponentLink1URL: https://ds.yuden.co.jp/TYCOMPAS/ut/detail?pn=FBTH1608HE102-T&u=M; ComponentLink2Description: DigiKey Link; ComponentLink2URL: http://digikey.com/product-detail/en/taiyo-yuden/FBTH1608HE102-T/587-6587-1-ND/10324935; Device Package: 0603 (1608 Metric); Height (Max): 0.037" (0.95mm); Impedance @ Frequency: 1 kOhms @ 100MHz; LastUpdated: 21/01/2020 02:28:14; Lifecycle Status: Active; Minimum Order: 1; Mounting Type: Surface Mount; Operating Temperature: -40°C ~ 150°C; Package / Case: 0603 (1608 Metric); Packaging: TapeAndReel; PartId: 702; Part Status: Active; Price: 0.09; Ratings: AEC-Q200; Series: FB; Size / Dimension: 0.063" L x 0.031" W (1.60mm x 0.80mm); Supplier 1: DigiKey; Supplier Part Number 1: 587-6587-1-ND; Value: 1 kOhms @ 100MHz
IC3 = DMG2305UX-13: MOSFET P-CH 20V 4.2A SOT23; Manufacturer: Diodes Incorporated; Current - Continuous Drain (Id) @ 25°C: 4.2A (Ta); Drive Voltage (Max Rds On,  Min Rds On): 1.8V, 4.5V; FET Type: P-Channel; Gate Charge (Qg) (Max) @ Vgs: 10.2nC @ 4.5V; Input Capacitance (Ciss) (Max) @ Vds: 808pF @ 15V; Power Dissipation (Max): 1.4W (Ta); Rds On (Max) @ Id, Vgs: 52mOhm @ 4.2A, 4.5V; Vgs (Max): ±8V; Vgs(th) (Max) @ Id: 900mV @ 250µA; Part Number: DMG2305UX-13; ComponentLink1Description: Datasheet; ComponentLink1URL: https://www.diodes.com/assets/Datasheets/DMG2305UX.pdf; ComponentLink2Description: DigiKey Link; ComponentLink2URL: http://digikey.com/product-detail/en/diodes-incorporated/DMG2305UX-13/DMG2305UX-13DICT-ND/4251589; Device Package: TO-236-3, SC-59, SOT-23-3; Drain to Source Voltage (Vdss): 20V; LastUpdated: 21/01/2020 04:00:37; Lifecycle Status: Active; Minimum Order: 1; Mounting Type: Surface Mount; Operating Temperature: -55°C ~ 150°C (TJ); Package / Case: TO-236-3, SC-59, SOT-23-3; Packaging: TapeAndReel; Part Status: Active; Price: 0.05; Series: -; Supplier 1: DigiKey; Supplier Part Number 1: DMG2305UX-13DICT-ND; Supplier Device Package: SOT-23; Technology: MOSFET (Metal Oxide)
IC6 = LPC11U36FBD48/401,: IC MCU 32BIT 96KB FLASH 48LQFP; Manufacturer: NXP USA Inc.; Connectivity: I²C, Microwire, SmartCard, SPI, SSP, UART/USART, USB; Core Processor: ARM® Cortex®-M0; Core Size: 32-Bit; Data Converters: A/D 8x10b; EEPROM Size: 4K x 8; Number of I/O: 40; Oscillator Type: Internal; Peripherals: Brown-out Detect/Reset, POR, WDT; Program Memory Size: 96KB (96K x 8); RAM Size: 10K x 8; Speed: 50MHz; Voltage - Supply (Vcc/Vdd): 1.8V ~ 3.6V; Part Number: LPC11U36FBD48/401,; ComponentLink1Description: Datasheet; ComponentLink1URL: https://www.nxp.com/docs/en/data-sheet/LPC11U3X.pdf; ComponentLink2Description: DigiKey Link; ComponentLink2URL: //digikey.com/product-detail/en/nxp-usa-inc/LPC11U36FBD48-401/568-9587-ND/3462840; Device Package: 48-LQFP; LastUpdated: 03/12/2019 15:42:55; Lifecycle Status: 0; Minimum Order: 1; Mounting Type: Surface Mount; Operating Temperature: -40°C ~ 85°C (TA); Package / Case: 48-LQFP; Packaging: Tray; PartId: 24; Part Status: Active; Price: 5.04; Program Memory Type: FLASH; Series: LPC11Uxx; Supplier 1: DigiKey; Supplier Part Number 1: 568-9587-ND; Supplier Device Package: 48-LQFP (7x7)
IC7 = PRTR5V0U2X,215: TVS DIODE 5.5V SOT143B; Manufacturer: Nexperia USA Inc.; Capacitance @ Frequency: 1pF @ 1MHz; Power Line Protection: Yes; Unidirectional Channels: 2; Voltage - Breakdown (Min): 6V; Voltage - Reverse Standoff (Typ): 5.5V (Max); Part Number: PRTR5V0U2X,215; Applications: General Purpose; ComponentLink1Description: Datasheet; ComponentLink1URL: https://assets.nexperia.com/documents/data-sheet/PRTR5V0U2X.pdf; ComponentLink2Description: DigiKey Link; ComponentLink2URL: //digikey.com/product-detail/en/nexperia-usa-inc/PRTR5V0U2X215/1727-3884-2-ND/1163690; Device Package: TO-253-4, TO-253AA; LastUpdated: 09/12/2019 21:29:05; Lifecycle Status: 0; Minimum Order: 1; Mounting Type: Surface Mount; Operating Temperature: -40°C ~ 85°C (TA); Package / Case: TO-253-4, TO-253AA; Packaging: TapeAndReel; PartId: 5451; Part Status: Active; Price: 0.18; Series: -; Supplier 1: DigiKey; Supplier Part Number 1: 1727-3884-2-ND; Supplier Device Package: SOT-143B; Type: Steering (Rail to Rail)
IC8 = STM6315SDW13F: IC SUPERVISOR 1 CHANNEL SOT143-4; Manufacturer: STMicroelectronics; Number of Voltages Monitored: 1; Output: Open Drain or Open Collector; Reset: Active Low; Reset Timeout: 112ms Minimum; Voltage - Threshold: 2.93V; Part Number: STM6315SDW13F; ComponentLink1Description: Datasheet; ComponentLink1URL: http://www.st.com/content/ccc/resource/technical/document/datasheet/64/6b/44/43/61/e6/41/d5/CD00081393.pdf/files/CD00081393.pdf/jcr:content/translations/en.CD00081393.pdf; ComponentLink2Description: DigiKey Link; ComponentLink2URL: http://digikey.com/product-detail/en/stmicroelectronics/STM6315SDW13F/497-4975-1-ND/1003446; Device Package: TO-253-4, TO-253AA; LastUpdated: 21/01/2020 03:59:26; Lifecycle Status: Active; Minimum Order: 1; Mounting Type: Surface Mount; Operating Temperature: -40°C ~ 125°C (TA); Package / Case: TO-253-4, TO-253AA; Packaging: TapeAndReel; Part Status: Active; Price: 0.23; Series: -; Supplier 1: DigiKey; Supplier Part Number 1: 497-4975-1-ND; Supplier Device Package: SOT-143-4; Type: Simple Reset/Power-On Reset
J1 = 10118193-0001LF: CONN RCPT USB2.0 MICRO B SMD R/A; Manufacturer: Amphenol ICC (FCI); Connector Type: USB - micro B; Current Rating (Amps): 1.8A per Contact; Gender: Receptacle; Mating Cycles: 10000; Number of Contacts: 5; Number of Ports: 1; Shielding: Shielded; Voltage - Rated: 100VAC; Part Number: 10118193-0001LF; ComponentLink1Description: Datasheet; ComponentLink1URL: https://cdn.amphenol-icc.com/media/wysiwyg/files/documentation/datasheet/inputoutput/io_usb_micro.pdf; ComponentLink2Description: DigiKey Link; ComponentLink2URL: //digikey.com/product-detail/en/amphenol-icc-fci/10118193-0001LF/609-4616-2-ND/2785388; Features: Solder Retention; LastUpdated: 09/12/2019 20:51:28; Lifecycle Status: 0; Minimum Order: 1; Mounting Feature: Horizontal; Mounting Type: Surface Mount, Right Angle; Through Hole; Operating Temperature: -30°C ~ 80°C; Packaging: TapeAndReel; Part Status: Active; Price: 0.21; Series: -; Specifications: USB 2.0; Supplier 1: DigiKey; Supplier Part Number 1: 609-4616-2-ND; Termination: Solder
J3 = 3221-10-0300-00: CONN HEADER SMD 10POS 1.27MM; Manufacturer: CNC Tech; Current Rating (Amps): 1A; Material Flammability Rating: UL94 V-0; Number of Positions: 10; Number of Positions Loaded: All; Pitch - Mating: 0.050" (1.27mm); Shrouding: Shrouded - 4 Wall; Style: Board to Cable/Wire; Part Number: 3221-10-0300-00; ComponentLink1Description: Datasheet; ComponentLink1URL: http://cnctech.us/idcmatching2.pdf; ComponentLink2Description: DigiKey Link; ComponentLink2URL: http://digikey.com/product-detail/en/cnc-tech/3221-10-0300-00/1175-1735-ND/4878946; Connector Type: Header; Contact Finish - Mating: Gold; Contact Finish - Post: Gold; Contact Finish Thickness - Mating: Flash; Contact Material: Brass; Contact Shape: Square; Contact Type: Male Pin; Fastening Type: Push-Pull; Features: Keying Slot; Insulation Height: 0.213" (5.40mm); Insulation Material: Polyamide (PA6T), Nylon 6T; LastUpdated: 13/01/2020 00:09:21; Lifecycle Status: Active; Minimum Order: 1; Mounting Type: Surface Mount; Number of Rows: 2; Operating Temperature: -40°C ~ 105°C; Packaging: Tray; PartId: 109; Part Status: Active; Price: 0.73; Row Spacing - Mating: 0.050" (1.27mm); Series: -; Supplier 1: DigiKey; Supplier Part Number 1: 1175-1735-ND; Termination: Solder
R13 = ERJ-3EKF2402V: RES SMD 24K OHM 1% 1/10W 0603; Manufacturer: Panasonic Electronic Components; Power (Watts): 0.1W, 1/10W; Temperature Coefficient: ±100ppm/°C; Part Number: ERJ-3EKF2402V; Value: 24 kOhms; ComponentLink1Description: Datasheet; ComponentLink1URL: https://industrial.panasonic.com/cdbs/www-data/pdf/RDA0000/AOA0000C304.pdf; ComponentLink2Description: DigiKey Link; ComponentLink2URL: http://digikey.com/product-detail/en/panasonic-electronic-components/ERJ-3EKF2402V/P24.0KHCT-ND/1746748; Composition: Thick Film; Device Package: 0603 (1608 Metric); Features: Automotive AEC-Q200; Height - Seated (Max): 0.022" (0.55mm); LastUpdated: 21/01/2020 00:17:12; Lifecycle Status: Active; Minimum Order: 1; Number of Terminations: 2; Operating Temperature: -55°C ~ 155°C; Package / Case: 0603 (1608 Metric); Packaging: TapeAndReel; PartId: 23079; Part Status: Active; Price: 0.01; Ratings: AEC-Q200; Resistance: 24 kOhms; Series: ERJ; Size / Dimension: 0.063" L x 0.031" W (1.60mm x 0.80mm); Supplier 1: DigiKey; Supplier Part Number 1: P24.0KHCT-ND; Supplier Device Package: 0603; Tolerance: ±1%
R14 = ERJ-3EKF2001V: RES SMD 2K OHM 1% 1/10W 0603; Manufacturer: Panasonic Electronic Components; Power (Watts): 0.1W, 1/10W; Temperature Coefficient: ±100ppm/°C; Part Number: ERJ-3EKF2001V; Value: 2 kOhms; ComponentLink1Description: Datasheet; ComponentLink1URL: https://industrial.panasonic.com/cdbs/www-data/pdf/RDA0000/AOA0000C304.pdf; ComponentLink2Description: DigiKey Link; ComponentLink2URL: http://digikey.com/product-detail/en/panasonic-electronic-components/ERJ-3EKF2001V/P2.00KHCT-ND/198219; Composition: Thick Film; Device Package: 0603 (1608 Metric); Features: Automotive AEC-Q200; Height - Seated (Max): 0.022" (0.55mm); LastUpdated: 21/01/2020 00:14:57; Lifecycle Status: Active; Minimum Order: 1; Number of Terminations: 2; Operating Temperature: -55°C ~ 155°C; Package / Case: 0603 (1608 Metric); Packaging: TapeAndReel; PartId: 25697; Part Status: Active; Price: 0.01; Ratings: AEC-Q200; Resistance: 2 kOhms; Series: ERJ; Size / Dimension: 0.063" L x 0.031" W (1.60mm x 0.80mm); Supplier 1: DigiKey; Supplier Part Number 1: P2.00KHCT-ND; Supplier Device Package: 0603; Tolerance: ±1%
R15 R24 = ERJ-PA3J202V: RES SMD 2K OHM 5% 1/4W 0603; Manufacturer: Panasonic Electronic Components; Power (Watts): 0.25W, 1/4W; Temperature Coefficient: ±200ppm/°C; Part Number: ERJ-PA3J202V; Value: 2 kOhms; ComponentLink1Description: Datasheet; ComponentLink1URL: https://industrial.panasonic.com/cdbs/www-data/pdf/RDO0000/AOA0000C331.pdf; ComponentLink2Description: DigiKey Link; ComponentLink2URL: http://digikey.com/product-detail/en/panasonic-electronic-components/ERJ-PA3J202V/P2KBZCT-ND/5036279; Composition: Thick Film; Device Package: 0603 (1608 Metric); Features: Automotive AEC-Q200, Pulse Withstanding; Height - Seated (Max): 0.022" (0.55mm); LastUpdated: 21/01/2020 00:23:23; Lifecycle Status: Active; Minimum Order: 1; Number of Terminations: 2; Operating Temperature: -55°C ~ 155°C; Package / Case: 0603 (1608 Metric); Packaging: TapeAndReel; PartId: 8961; Part Status: Active; Price: 0.01; Ratings: AEC-Q200; Resistance: 2 kOhms; Series: ERJ; Size / Dimension: 0.063" L x 0.031" W (1.60mm x 0.80mm); Supplier 1: DigiKey; Supplier Part Number 1: P2KBZCT-ND; Supplier Device Package: 0603; Tolerance: ±5%
R16 = ERJ-3EKF1501V: RES SMD 1.5K OHM 1% 1/10W 0603; Manufacturer: Panasonic Electronic Components; Power (Watts): 0.1W, 1/10W; Temperature Coefficient: ±100ppm/°C; Part Number: ERJ-3EKF1501V; Value: 1.5 kOhms; ComponentLink1Description: Datasheet; ComponentLink1URL: https://industrial.panasonic.com/cdbs/www-data/pdf/RDA0000/AOA0000C304.pdf; ComponentLink2Description: DigiKey Link; ComponentLink2URL: http://digikey.com/product-detail/en/panasonic-electronic-components/ERJ-3EKF1501V/P1.50KHCT-ND/198088; Composition: Thick Film; Device Package: 0603 (1608 Metric); Features: Automotive AEC-Q200; Height - Seated (Max): 0.022" (0.55mm); LastUpdated: 21/01/2020 00:24:38; Lifecycle Status: Active; Minimum Order: 1; Number of Terminations: 2; Operating Temperature: -55°C ~ 155°C; Package / Case: 0603 (1608 Metric); Packaging: TapeAndReel; PartId: 5637; Part Status: Active; Price: 0.01; Ratings: AEC-Q200; Resistance: 1.5 kOhms; Series: ERJ; Size / Dimension: 0.063" L x 0.031" W (1.60mm x 0.80mm); Supplier 1: DigiKey; Supplier Part Number 1: P1.50KHCT-ND; Supplier Device Package: 0603; Tolerance: ±1%
R17 R18 = ERJ-3EKF33R0V: RES SMD 33 OHM 1% 1/10W 0603; Manufacturer: Panasonic Electronic Components; Power (Watts): 0.1W, 1/10W; Temperature Coefficient: ±100ppm/°C; Part Number: ERJ-3EKF33R0V; Value: 33 Ohms; ComponentLink1Description: Datasheet; ComponentLink1URL: https://industrial.panasonic.com/cdbs/www-data/pdf/RDA0000/AOA0000C304.pdf; ComponentLink2Description: DigiKey Link; ComponentLink2URL: http://digikey.com/product-detail/en/panasonic-electronic-components/ERJ-3EKF33R0V/P33.0HCT-ND/1746765; Composition: Thick Film; Device Package: 0603 (1608 Metric); Features: Automotive AEC-Q200; Height - Seated (Max): 0.022" (0.55mm); LastUpdated: 21/01/2020 00:24:38; Lifecycle Status: Active; Minimum Order: 1; Number of Terminations: 2; Operating Temperature: -55°C ~ 155°C; Package / Case: 0603 (1608 Metric); Packaging: TapeAndReel; PartId: 5660; Part Status: Active; Price: 0.01; Ratings: AEC-Q200; Resistance: 33 Ohms; Series: ERJ; Size / Dimension: 0.063" L x 0.031" W (1.60mm x 0.80mm); Supplier 1: DigiKey; Supplier Part Number 1: P33.0HCT-ND; Supplier Device Package: 0603; Tolerance: ±1%
R23 = ERJ-3EKF1002V: RES SMD 10K OHM 1% 1/10W 0603; Manufacturer: Panasonic Electronic Components; Power (Watts): 0.1W, 1/10W; Temperature Coefficient: ±100ppm/°C; Part Number: ERJ-3EKF1002V; Value: 10 kOhms; ComponentLink1Description: Datasheet; ComponentLink1URL: https://industrial.panasonic.com/cdbs/www-data/pdf/RDA0000/AOA0000C304.pdf; ComponentLink2Description: DigiKey Link; ComponentLink2URL: http://digikey.com/product-detail/en/panasonic-electronic-components/ERJ-3EKF1002V/P10.0KHCT-ND/198102; Composition: Thick Film; Device Package: 0603 (1608 Metric); Features: Automotive AEC-Q200; Height - Seated (Max): 0.022" (0.55mm); LastUpdated: 21/01/2020 00:14:57; Lifecycle Status: Active; Minimum Order: 1; Number of Terminations: 2; Operating Temperature: -55°C ~ 155°C; Package / Case: 0603 (1608 Metric); Packaging: TapeAndReel; PartId: 25695; Part Status: Active; Price: 0.01; Ratings: AEC-Q200; Resistance: 10 kOhms; Series: ERJ; Size / Dimension: 0.063" L x 0.031" W (1.60mm x 0.80mm); Supplier 1: DigiKey; Supplier Part Number 1: P10.0KHCT-ND; Supplier Device Package: 0603; Tolerance: ±1%
S1 S2 = FSMSMTR: SWITCH TACTILE SPST-NO 0.05A 24V; Manufacturer: TE Connectivity ALCOSWITCH Switches; Actuator Height off PCB, Vertical: 4.57mm; Actuator Orientation: Top Actuated; Actuator Type: Standard; Contact Rating @ Voltage: 0.05A @ 24VDC; Illumination: Non-Illuminated; Operating Force: 180gf; Outline: 6.00mm x 3.50mm; Switch Function: Off-Mom; Part Number: FSMSMTR; Circuit: SPST-NO; ComponentLink1Description: Datasheet; ComponentLink1URL: https://www.te.com/commerce/DocumentDelivery/DDEController?Action=srchrtrv&DocNm=1437566-3&DocType=Customer+Drawing&DocLang=English; ComponentLink2Description: DigiKey Link; ComponentLink2URL: http://digikey.com/product-detail/en/te-connectivity-alcoswitch-switches/FSMSMTR/450-1758-1-ND/2271637; LastUpdated: 25/01/2020 20:03:55; Lifecycle Status: Active; Minimum Order: 1; Mounting Type: Surface Mount; Operating Temperature: -35°C ~ 85°C; Packaging: TapeAndReel; Part Status: Active; Price: 0.19; Series: FSMSM; Supplier 1: DigiKey; Supplier Part Number 1: 450-1758-1-ND; Termination Style: Gull Wing
Y1 = ABM8G-106-12.000MHZ-T: IOT 12MHZ 10PF XTAL; Manufacturer: Abracon LLC; ESR (Equivalent Series Resistance): 120 Ohms; Frequency Stability: ±30ppm; Frequency Tolerance: ±20ppm; Operating Mode: Fundamental; Part Number: ABM8G-106-12.000MHZ-T; ComponentLink1Description: Datasheet; ComponentLink1URL: https://abracon.com/datasheets/ABM8G-106-12.000MHz-T.pdf; ComponentLink2Description: DigiKey Link; ComponentLink2URL: http://digikey.com/product-detail/en/abracon-llc/ABM8G-106-12.000MHZ-T/535-14512-1-ND/8827203; Device Package: 4-SMD, No Lead; Frequency: 12MHz; Height - Seated (Max): 0.039" (1.00mm); LastUpdated: 15/01/2020 00:15:56; Lifecycle Status: Active; Load Capacitance: 10pF; Minimum Order: 1; Mounting Type: Surface Mount; Operating Temperature: -40°C ~ 85°C; Package / Case: 4-SMD, No Lead; Packaging: TapeAndReel; PartId: 308; Part Status: Active; Price: 0.26; Series: ABM8G; Size / Dimension: 0.126" L x 0.098" W (3.20mm x 2.50mm); Supplier 1: DigiKey; Supplier Part Number 1: 535-14512-1-ND; Type: MHz Crystal; Value: 12MHz